# Altium schematic sheet [11] - IO.SchDoc: IO
size A4; Organization: Bjørn T. Brodtkorb; Address1: Frode Rinnans veg 161; Address2: 7050 Trondheim; DocumentNumber: 6598; Revision: 1.0; SheetNumber: 1; SheetTotal: 1
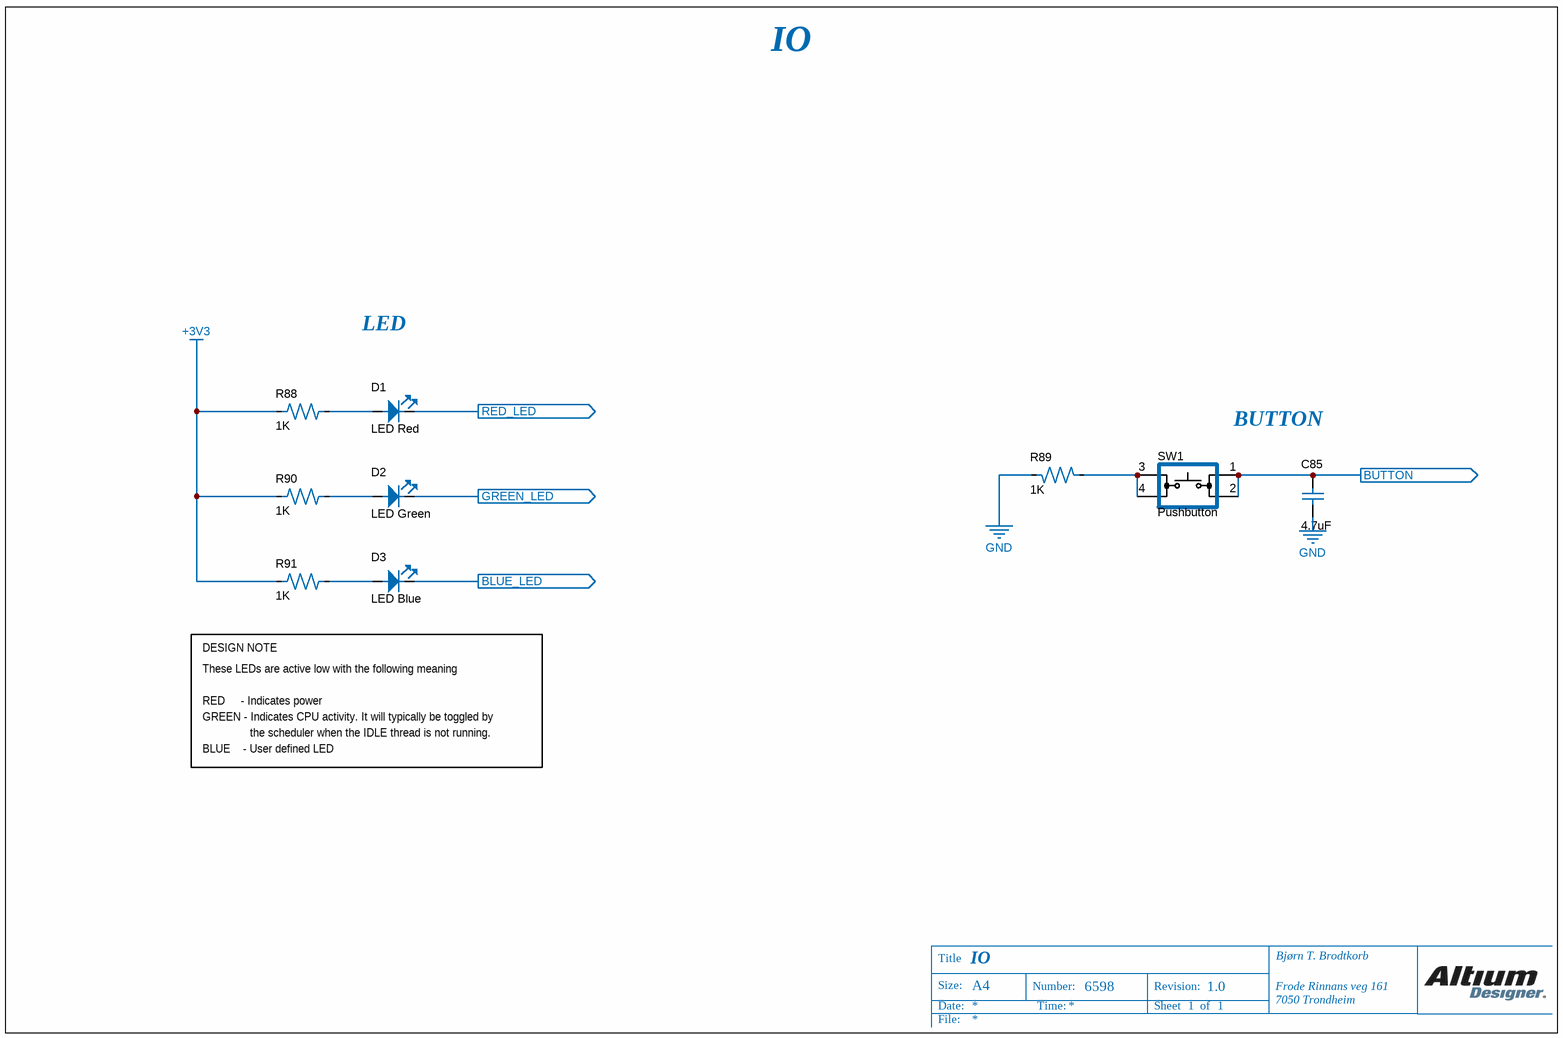
[diagram p0: [11] - IO.SchDoc]

## Parts
C85  value 4.7uF  [C0603]  (hidden comment: 02016D104KAT2A)
D1  LED Red  [L0603 RED]
D2  LED Green  [L0603 GREEN]
D3  LED Blue  [L0603 BLUE]
R88  value 1K  [R0402]  (hidden comment: CRCW04020000Z0ED)
R89  value 1K  [R0603]  (hidden comment: CPF-A-0603B100KE1)
R90  value 1K  [R0402]  (hidden comment: CRCW04020000Z0ED)
R91  value 1K  [R0402]  (hidden comment: CRCW04020000Z0ED)
SW1  Pushbutton  [KSC222G LFS]

## Ports
BLUE_LED (out), BUTTON (out), GREEN_LED (out), RED_LED (out)

## Nets
+3V3: R88.1 R90.1 R91.1
GND: C85.1 R89.2
BLUE_LED: D3.2 ; port BLUE_LED
BUTTON: C85.2 SW1.1 SW1.2 ; port BUTTON
GREEN_LED: D2.2 ; port GREEN_LED
RED_LED: D1.2 ; port RED_LED
NetD1_1: D1.1 R88.2
NetD2_1: D2.1 R90.2
NetD3_1: D3.1 R91.2
NetR89_1: R89.1 SW1.3 SW1.4

## Notes on the sheet
- IO
- LED
- (near SW1) BUTTON
- DESIGN NOTE
- These LEDs are active low with the following meaning
- RED     - Indicates power
- GREEN - Indicates CPU activity. It will typically be toggled by
- BLUE    - User defined LED
- the scheduler when the IDLE thread is not running.
- Title
- Size:
- A4
- Number:
- Revision:
- Date:
- File:
- Time:
- Sheet
- of

## Library data of the parts
C85 = 02016D104KAT2A: C0603
D1 = HSMG-C190: LED 0603 Red
D2 = HSMG-C196: LED 0603 Green
D3 = HSMG-C199: LED 0603 Blue
R88 R90 R91 = CRCW04020000Z0ED: R0402
R89 = CPF-A-0603B100KE1: R0603
SW1 = KSC222G LFS: Pushbutton SMD; Supplier Part Number 1: 2845714; Supplier 1: Farnell